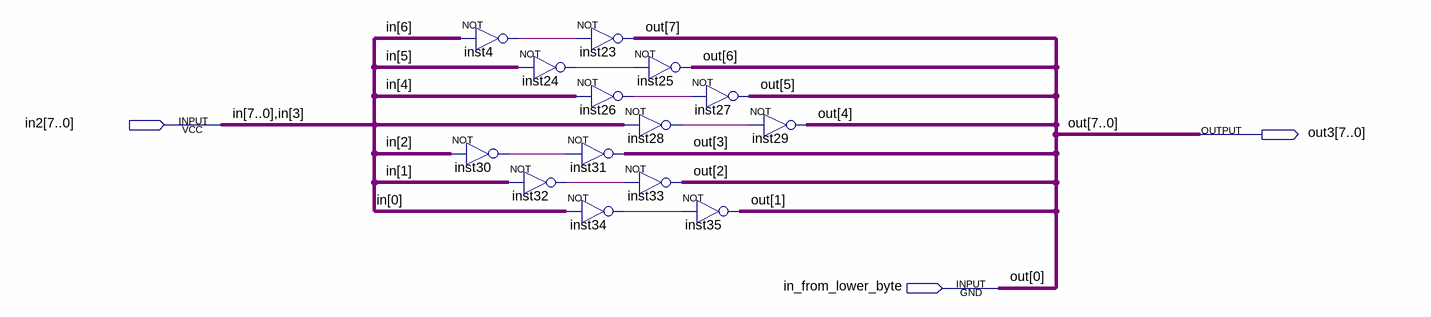
[diagram p0: schematic sheet]
// Quartus schematic LSR.bdf as structural Verilog: 14 symbols, 3 pins
module LSR (
  input  [7:0] in2,
  input  in_from_lower_byte,
  output [7:0] out3
);

  wire inst4_out, inst24_out, inst26_out, inst28_out, inst30_out, inst32_out, inst34_out;
  wire [7:0] in;

  not inst30 (inst30_out, in[2]);
  not inst4 (inst4_out, in[6]);
  not inst24 (inst24_out, in[5]);
  not inst32 (inst32_out, in[1]);
  not inst23 (out3[7], inst4_out);
  not inst26 (inst26_out, in[4]);
  not inst31 (out3[3], inst30_out);
  not inst34 (inst34_out, in[0]);
  not inst25 (out3[6], inst24_out);
  assign inst28_out = ~{in, in[3]};  // NOT inst28, 9 bits wide
  not inst33 (out3[2], inst32_out);
  not inst35 (out3[1], inst34_out);
  not inst27 (out3[5], inst26_out);
  not inst29 (out3[4], inst28_out);

  assign out3[0] = in_from_lower_byte;

  // Other names for the same wires on the sheet: out[7:0] = {out3[7:1], in_from_lower_byte}
endmodule
